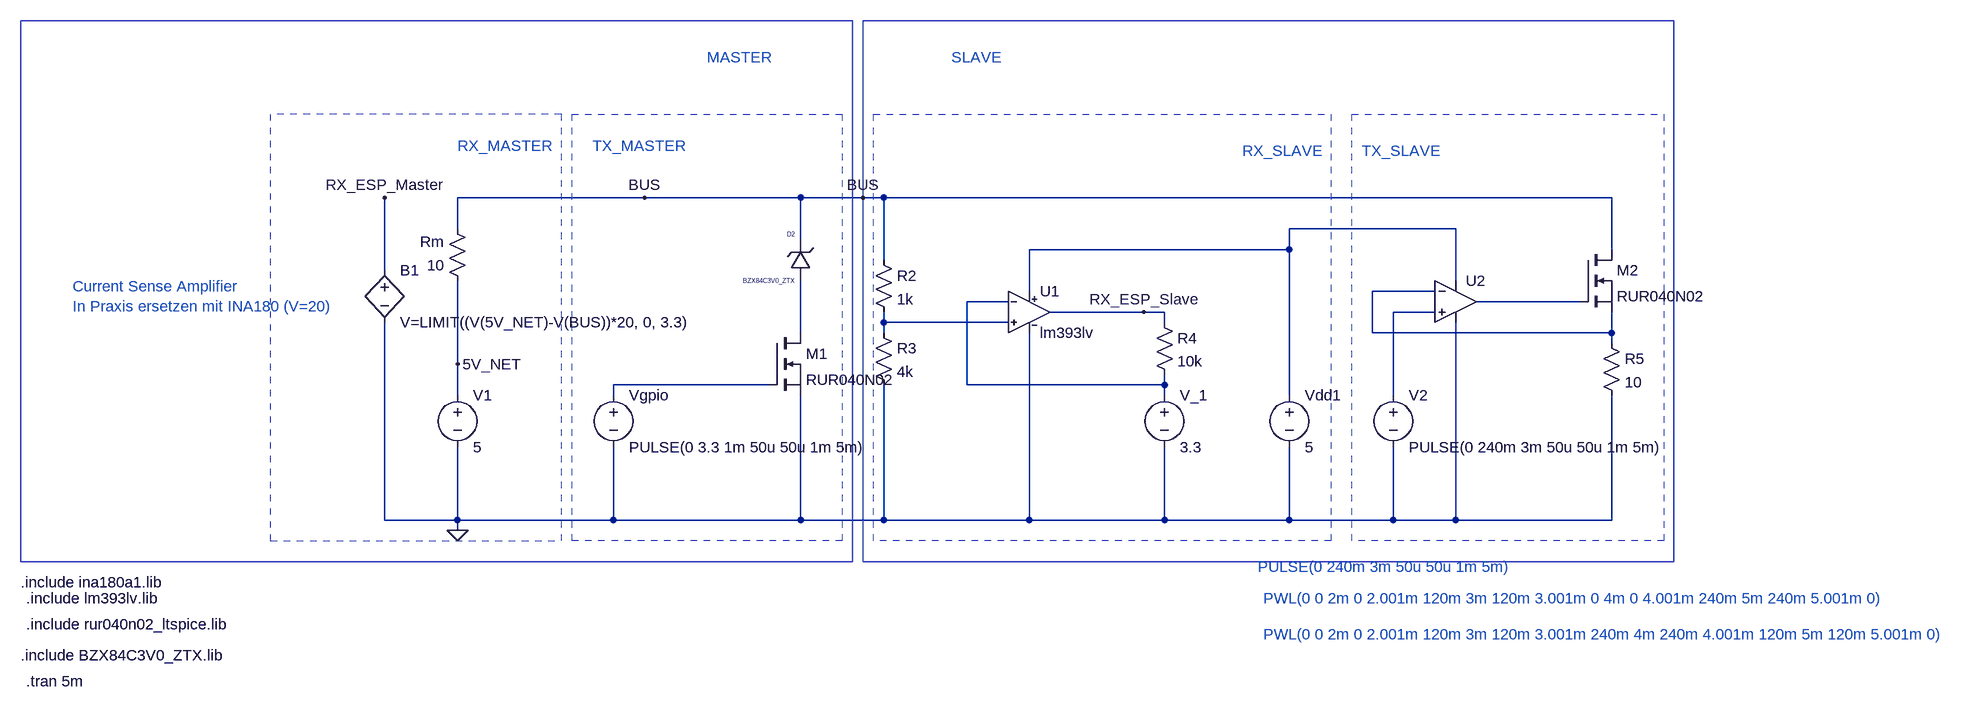
[diagram p0: schematic Master_Slave_bv.asc]
Master_Slave_bv.asc, the LTspice schematic file:
Version 4.1
SHEET 1 2652 728
WIRE 336 -48 48 -48
WIRE 576 -48 336 -48
WIRE 672 -48 576 -48
WIRE 704 -48 672 -48
WIRE 1824 -48 704 -48
WIRE 48 0 48 -48
WIRE 1584 0 1328 0
WIRE 576 16 576 -48
WIRE 1328 32 1328 0
WIRE 1328 32 928 32
WIRE 1824 32 1824 -48
WIRE 704 48 704 -48
WIRE -64 64 -64 -48
WIRE 1584 80 1584 0
WIRE 928 96 928 32
WIRE 1552 96 1456 96
WIRE 896 112 832 112
WIRE 1776 112 1616 112
WIRE 1104 128 960 128
WIRE 1136 128 1104 128
WIRE 1552 128 1488 128
WIRE 704 144 704 128
WIRE 896 144 704 144
WIRE 1136 144 1136 128
WIRE 576 160 576 80
WIRE 704 160 704 144
WIRE 1456 160 1456 96
WIRE 1824 160 1824 128
WIRE 1824 160 1456 160
WIRE 1824 176 1824 160
WIRE 48 208 48 80
WIRE 528 240 288 240
WIRE 832 240 832 112
WIRE 1136 240 1136 224
WIRE 1136 240 832 240
WIRE 48 256 48 208
WIRE 288 256 288 240
WIRE 1136 256 1136 240
WIRE 1328 256 1328 32
WIRE 1488 256 1488 128
WIRE -64 448 -64 144
WIRE 48 448 48 336
WIRE 48 448 -64 448
WIRE 288 448 288 336
WIRE 288 448 48 448
WIRE 576 448 576 256
WIRE 576 448 288 448
WIRE 704 448 704 240
WIRE 704 448 576 448
WIRE 928 448 928 160
WIRE 928 448 704 448
WIRE 1136 448 1136 336
WIRE 1136 448 928 448
WIRE 1328 448 1328 336
WIRE 1328 448 1136 448
WIRE 1488 448 1488 336
WIRE 1488 448 1328 448
WIRE 1584 448 1584 144
WIRE 1584 448 1488 448
WIRE 1824 448 1824 256
WIRE 1824 448 1584 448
WIRE 48 464 48 448
FLAG 48 464 0
FLAG 336 -48 BUS
FLAG -64 -48 RX_ESP_Master
FLAG 672 -48 BUS
FLAG 1104 128 RX_ESP_Slave
FLAG 48 208 5V_NET
SYMBOL voltage 48 240 R0
SYMATTR InstName V1
SYMATTR Value 5
SYMBOL res 64 96 R180
WINDOW 0 36 76 Left 2
WINDOW 3 36 40 Left 2
SYMATTR InstName Rm
SYMATTR Value 10
SYMBOL lib\\sym\\EIT_Semiconductors\\nmos 528 160 R0
SYMATTR InstName M1
SYMATTR Value RUR040N02
SYMATTR Prefix X
SYMBOL voltage 288 240 R0
SYMATTR Value PULSE(0 3.3 1m 50u 50u 1m 5m)
SYMATTR InstName Vgpio
SYMBOL zener 592 80 R180
WINDOW 0 24 72 Left 0
WINDOW 3 24 0 Left 0
SYMATTR InstName D2
SYMATTR Value BZX84C3V0_ZTX
SYMBOL voltage 1328 240 R0
SYMATTR InstName Vdd1
SYMATTR Value 5
SYMBOL voltage 1136 240 R0
SYMATTR InstName V_1
SYMATTR Value 3.3
SYMBOL res 688 32 R0
SYMATTR InstName R2
SYMATTR Value 1k
SYMBOL res 688 144 R0
SYMATTR InstName R3
SYMATTR Value 4k
SYMBOL res 1120 128 R0
SYMATTR InstName R4
SYMATTR Value 10k
SYMBOL LM393 928 128 R0
SYMATTR InstName U1
SYMATTR Value lm393lv
SYMATTR SpiceModel ""
SYMBOL lib\\sym\\EIT_Semiconductors\\nmos 1776 32 R0
SYMATTR InstName M2
SYMATTR Value RUR040N02
SYMATTR Prefix X
SYMBOL res 1808 160 R0
SYMATTR InstName R5
SYMATTR Value 10
SYMBOL lib\\sym\\Opamps\\UniversalOpamp2 1584 112 R0
SYMATTR InstName U2
SYMBOL voltage 1488 240 R0
SYMATTR InstName V2
SYMATTR Value PULSE(0 240m 3m 50u 50u 1m 5m)
SYMBOL lib\\sym\\Linear_Original\\bv -64 48 R0
SYMATTR InstName B1
SYMATTR Value V=LIMIT((V(5V_NET)-V(BUS))*20, 0, 3.3)
TEXT -616 608 Left 2 !.include rur040n02_ltspice.lib
TEXT -624 656 Left 2 !.include BZX84C3V0_ZTX.lib
TEXT -616 696 Left 2 !.tran 5m
TEXT 1280 520 Left 2 ;PULSE(0 240m 3m 50u 50u 1m 5m)
TEXT -616 568 Left 2 !.include lm393lv.lib
TEXT 432 -264 Left 2 ;MASTER
TEXT 808 -264 Left 2 ;SLAVE
TEXT -624 544 Left 2 !.include ina180a1.lib
TEXT 1256 -120 Left 2 ;RX_SLAVE
TEXT 1440 -120 Left 2 ;TX_SLAVE
TEXT 256 -128 Left 2 ;TX_MASTER
TEXT 48 -128 Left 2 ;RX_MASTER
TEXT -544 88 Left 2 ;Current Sense Amplifier\nIn Praxis ersetzen mit INA180 (V=20)
TEXT 1288 568 Left 2 ;PWL(0 0 2m 0 2.001m 120m 3m 120m 3.001m 0 4m 0 4.001m 240m 5m 240m 5.001m 0)
TEXT 1288 624 Left 2 ;PWL(0 0 2m 0 2.001m 120m 3m 120m 3.001m 240m 4m 240m 4.001m 120m 5m 120m 5.001m 0)
RECTANGLE Normal 656 512 -624 -320
RECTANGLE Normal 1920 512 672 -320
RECTANGLE Normal 1392 480 688 -176 2
RECTANGLE Normal 1904 480 1424 -176 2
RECTANGLE Normal 640 480 224 -176 2
RECTANGLE Normal -240 480 208 -176 2

The netlist it stands for:
* Master_Slave_bv.asc
V1 5V_NET 0 5
Rm 5V_NET BUS 10
X§M1 N007 N008 0 RUR040N02  ; pins D G S
Vgpio N008 0 PULSE(0 3.3 1m 50u 50u 1m 5m)
D2 N007 BUS BZX84C3V0_ZTX
Vdd1 N001 0 5
V_1 N003 0 3.3
R2 BUS N006 1k
R3 N006 0 4k
R4 RX_ESP_Slave N003 10k
X§U1 N006 N003 N001 0 RX_ESP_Slave lm393lv  ; pins In+ In- V+ V- OUT
X§M2 BUS N004 N002 RUR040N02  ; pins D G S
R5 N002 0 10
X§U2 N005 N002 N001 0 N004 level.2 Avol=1Meg GBW=10Meg Slew=10Meg ilimit=25m rail=0 Vos=0 phimargin=45 en=0 enk=0 in=0 ink=0 Rin=500Meg  ; pins IN+ IN- V+ V- OUT
V2 N005 0 PULSE(0 240m 3m 50u 50u 1m 5m)
B1 RX_ESP_Master 0 V=LIMIT((V(5V_NET)-V(BUS))*20, 0, 3.3)
.model D D
.lib standard.dio
.include rur040n02_ltspice.lib
.include BZX84C3V0_ZTX.lib
.tran 5m
* PULSE(0 240m 3m 50u 50u 1m 5m)
.include lm393lv.lib
* MASTER
* SLAVE
.include ina180a1.lib
* RX_SLAVE
* TX_SLAVE
* TX_MASTER
* RX_MASTER
* Current Sense Amplifier
* In Praxis ersetzen mit INA180 (V=20)
* PWL(0 0 2m 0 2.001m 120m 3m 120m 3.001m 0 4m 0 4.001m 240m 5m 240m 5.001m 0)
* PWL(0 0 2m 0 2.001m 120m 3m 120m 3.001m 240m 4m 240m 4.001m 120m 5m 120m 5.001m 0)
.lib UniversalOpamps2.sub
.backanno
.end